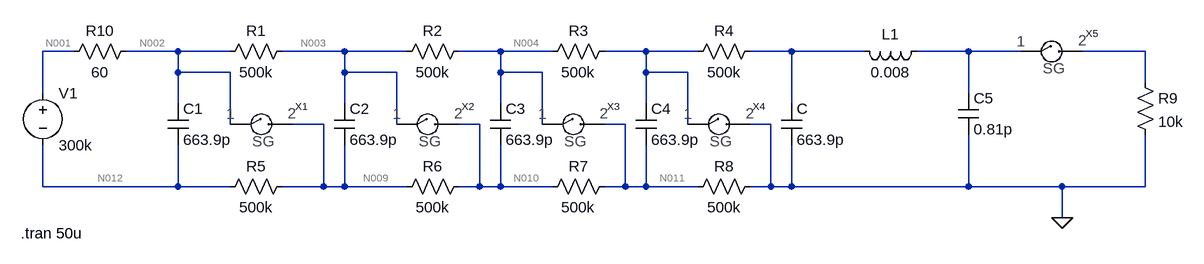
[diagram p0: schematic Draft1.asc]
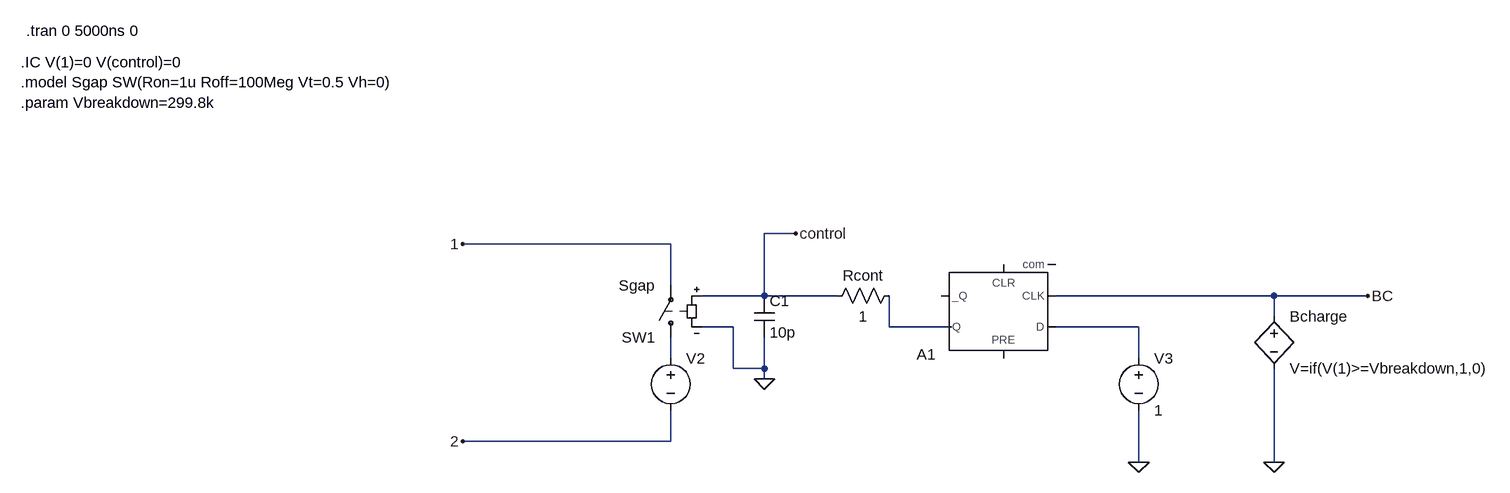
[diagram p1: sub-circuit sg_model.asc]
Draft1.asc, the LTspice schematic file:
Version 4
SHEET 1 880 680
WIRE -1280 -16 -1328 -16
WIRE -1120 -16 -1200 -16
WIRE -1040 -16 -1120 -16
WIRE -864 -16 -960 -16
WIRE -768 -16 -864 -16
WIRE -624 -16 -688 -16
WIRE -544 -16 -624 -16
WIRE -400 -16 -464 -16
WIRE -320 -16 -400 -16
WIRE -176 -16 -240 -16
WIRE -64 -16 -176 -16
WIRE 96 -16 16 -16
WIRE 176 -16 96 -16
WIRE 368 -16 272 -16
WIRE -1120 16 -1120 -16
WIRE -1040 16 -1120 16
WIRE -864 16 -864 -16
WIRE -784 16 -864 16
WIRE -624 16 -624 -16
WIRE -560 16 -624 16
WIRE -400 16 -400 -16
WIRE -336 16 -400 16
WIRE 368 32 368 -16
WIRE -1328 48 -1328 -16
WIRE 96 48 96 -16
WIRE -1120 64 -1120 16
WIRE -864 64 -864 16
WIRE -624 64 -624 16
WIRE -400 64 -400 16
WIRE -176 64 -176 -16
WIRE -1040 96 -1040 16
WIRE -896 96 -944 96
WIRE -784 96 -784 16
WIRE -656 96 -688 96
WIRE -560 96 -560 16
WIRE -432 96 -464 96
WIRE -336 96 -336 16
WIRE -208 96 -240 96
WIRE -1328 192 -1328 128
WIRE -1120 192 -1120 128
WIRE -1120 192 -1328 192
WIRE -1040 192 -1120 192
WIRE -896 192 -896 96
WIRE -896 192 -960 192
WIRE -864 192 -864 128
WIRE -864 192 -896 192
WIRE -768 192 -864 192
WIRE -656 192 -656 96
WIRE -656 192 -688 192
WIRE -624 192 -624 128
WIRE -624 192 -656 192
WIRE -544 192 -624 192
WIRE -432 192 -432 96
WIRE -432 192 -464 192
WIRE -400 192 -400 128
WIRE -400 192 -432 192
WIRE -320 192 -400 192
WIRE -208 192 -208 96
WIRE -208 192 -240 192
WIRE -176 192 -176 128
WIRE -176 192 -208 192
WIRE 96 192 96 112
WIRE 96 192 -176 192
WIRE 240 192 96 192
WIRE 368 192 368 112
WIRE 368 192 240 192
WIRE 240 240 240 192
FLAG 240 240 0
SYMBOL cap -1136 64 R0
SYMATTR InstName C1
SYMATTR Value 663.9p
SYMBOL cap -880 64 R0
SYMATTR InstName C2
SYMATTR Value 663.9p
SYMBOL cap -640 64 R0
SYMATTR InstName C3
SYMATTR Value 663.9p
SYMBOL cap -416 64 R0
SYMATTR InstName C4
SYMATTR Value 663.9p
SYMBOL cap -192 64 R0
SYMATTR InstName C
SYMATTR Value 663.9p
SYMBOL res -944 -32 R90
WINDOW 0 0 56 VBottom 2
WINDOW 3 32 56 VTop 2
SYMATTR InstName R1
SYMATTR Value 500k
SYMBOL res -672 -32 R90
WINDOW 0 0 56 VBottom 2
WINDOW 3 32 56 VTop 2
SYMATTR InstName R2
SYMATTR Value 500k
SYMBOL res -448 -32 R90
WINDOW 0 0 56 VBottom 2
WINDOW 3 32 56 VTop 2
SYMATTR InstName R3
SYMATTR Value 500k
SYMBOL res -224 -32 R90
WINDOW 0 0 56 VBottom 2
WINDOW 3 32 56 VTop 2
SYMATTR InstName R4
SYMATTR Value 500k
SYMBOL res -944 176 R90
WINDOW 0 0 56 VBottom 2
WINDOW 3 32 56 VTop 2
SYMATTR InstName R5
SYMATTR Value 500k
SYMBOL res -672 176 R90
WINDOW 0 0 56 VBottom 2
WINDOW 3 32 56 VTop 2
SYMATTR InstName R6
SYMATTR Value 500k
SYMBOL res -448 176 R90
WINDOW 0 0 56 VBottom 2
WINDOW 3 32 56 VTop 2
SYMATTR InstName R7
SYMATTR Value 500k
SYMBOL res -224 176 R90
WINDOW 0 0 56 VBottom 2
WINDOW 3 32 56 VTop 2
SYMATTR InstName R8
SYMATTR Value 500k
SYMBOL sg_model -992 96 R0
SYMATTR InstName X1
SYMBOL sg_model -736 96 R0
SYMATTR InstName X2
SYMBOL sg_model -512 96 R0
SYMATTR InstName X3
SYMBOL sg_model -288 96 R0
SYMATTR InstName X4
SYMBOL sg_model 224 -16 R0
SYMATTR InstName X5
SYMBOL ind 32 -32 R90
WINDOW 0 5 56 VBottom 2
WINDOW 3 32 56 VTop 2
SYMATTR InstName L1
SYMATTR Value 0.008
SYMBOL cap 80 48 R0
SYMATTR InstName C5
SYMATTR Value 0.81p
SYMBOL res 352 16 R0
SYMATTR InstName R9
SYMATTR Value 10k
SYMBOL voltage -1328 32 R0
SYMATTR InstName V1
SYMATTR Value 300k
SYMBOL res -1184 -32 R90
WINDOW 0 0 56 VBottom 2
WINDOW 3 32 56 VTop 2
SYMATTR InstName R10
SYMATTR Value 60
TEXT -1362 264 Left 2 !.tran 50u

sg_model.asc, the sub-circuit schematic file:
Version 4
SHEET 1 1600 680
WIRE 464 64 416 64
WIRE 272 80 -48 80
WIRE 272 144 272 80
WIRE 416 160 416 64
WIRE 416 160 320 160
WIRE 528 160 416 160
WIRE 1200 160 864 160
WIRE 1344 160 1200 160
WIRE 1200 192 1200 160
WIRE 368 208 320 208
WIRE 608 208 608 160
WIRE 704 208 608 208
WIRE 992 208 864 208
WIRE 272 256 272 224
WIRE 992 256 992 208
WIRE 368 272 368 208
WIRE 416 272 416 224
WIRE 416 272 368 272
WIRE 416 288 416 272
WIRE 272 384 272 336
WIRE 272 384 -48 384
WIRE 992 416 992 336
WIRE 1200 416 1200 272
FLAG 416 288 0
FLAG 992 416 0
FLAG 1200 416 0
FLAG 464 64 control
FLAG 1344 160 BC
FLAG -48 80 1
FLAG -48 384 2
SYMBOL voltage 992 240 R0
WINDOW 123 0 0 Left 0
WINDOW 39 0 0 Left 0
SYMATTR InstName V3
SYMATTR Value 1
SYMBOL voltage 272 240 R0
WINDOW 123 0 0 Left 0
WINDOW 39 24 44 Left 2
SYMATTR InstName V2
SYMATTR Value ""
SYMBOL res 624 144 R90
WINDOW 0 0 56 VBottom 2
WINDOW 3 32 56 VTop 2
SYMATTR InstName Rcont
SYMATTR Value 1
SYMBOL cap 400 160 R0
SYMATTR InstName C1
SYMATTR Value 10p
SYMBOL bv 1200 176 R0
SYMATTR InstName Bcharge
SYMATTR Value V=if(V(1)>=Vbreakdown,1,0)
SYMBOL Digital\\dflop 784 256 R180
SYMATTR InstName A1
SYMBOL sw 272 240 R180
SYMATTR InstName SW1
SYMATTR Value Sgap
TEXT -728 -200 Left 2 !.IC V(1)=0 V(control)=0\n.model Sgap SW(Ron=1u Roff=100Meg Vt=0.5 Vh=0)\n.param Vbreakdown=299.8k
TEXT -720 -248 Left 2 !.tran 0 5000ns 0

The netlist it stands for:
* Draft1.asc
C1 N002 N012 663.9p
C2 N003 N009 663.9p
C3 N004 N010 663.9p
C4 N005 N011 663.9p
C N006 0 663.9p
R1 N003 N002 500k
R2 N004 N003 500k
R3 N005 N004 500k
R4 N006 N005 500k
R5 N009 N012 500k
R6 N010 N009 500k
R7 N011 N010 500k
R8 0 N011 500k
XX1 N002 N009 sg_model
XX2 N003 N010 sg_model
XX3 N004 N011 sg_model
XX4 N005 0 sg_model
XX5 N007 N008 sg_model
L1 N007 N006 0.008
C5 N007 0 0.81p
R9 N008 0 10k
V1 N001 N012 300k
R10 N002 N001 60

* block symbol definitions
.subckt sg_model 1 2
V3 N002 0 1
V2 N003 2
Rcont N001 control 1
C1 control 0 10p
Bcharge BC 0 V=if(V(1)>=Vbreakdown,1,0)
A1 N002 0 BC 0 0 0 N001 0 DFLOP
SW1 N003 1 control 0 Sgap
.IC V(1)=0 V(control)=0
.model Sgap SW(Ron=1u Roff=100Meg Vt=0.5 Vh=0)
.param Vbreakdown=299.8k
.tran 0 5000ns 0
.ends sg_model

.tran 50u
.backanno
.end

* Results of the author's LTspice run, read from the files saved beside the schematic
* Operating Point, zero values left out:
*   V(n012) = -300 kV
*   V(n009) = -223.7 kV
*   V(n010) = -148.5 kV
*   V(n011) = -74.07 kV
*   V(n001) = 9.156 V
*   I(R10) = -152.6 mA
*   I(R8) = 148.1 mA
*   I(R7) = 148.9 mA
*   I(R6) = 150.4 mA
*   I(R5) = 152.6 mA
*   I(V1) = -152.6 mA
*   Ix(x1:1) = 2.237 mA
*   Ix(x1:2) = -2.237 mA
*   Ix(x2:1) = 1.485 mA
*   Ix(x2:2) = -1.485 mA
*   Ix(x3:1) = 740.8 µA
*   Ix(x3:2) = -740.8 µA
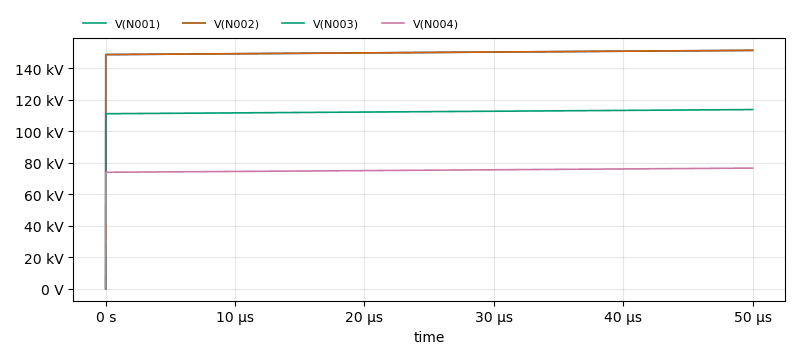
[diagram p2: Transient Analysis of Draft1.asc, plotted from the saved traces]
* Transient Analysis, 1 run:
*   V(N001): min 9.156 V, max 151.2 kV, average 149.9 kV, rms 149.9 kV, last 151.2 kV
*   V(N002): min 0 V, max 151.2 kV, average 149.9 kV, rms 149.9 kV, last 151.2 kV
*   V(N003): min 0 V, max 113.6 kV, average 112.3 kV, rms 112.3 kV, last 113.6 kV
*   V(N004): min 0 V, max 76.53 kV, average 75.22 kV, rms 75.23 kV, last 76.53 kV